# EAGLE design TS_OD1 (EAGLE 7.2.0)
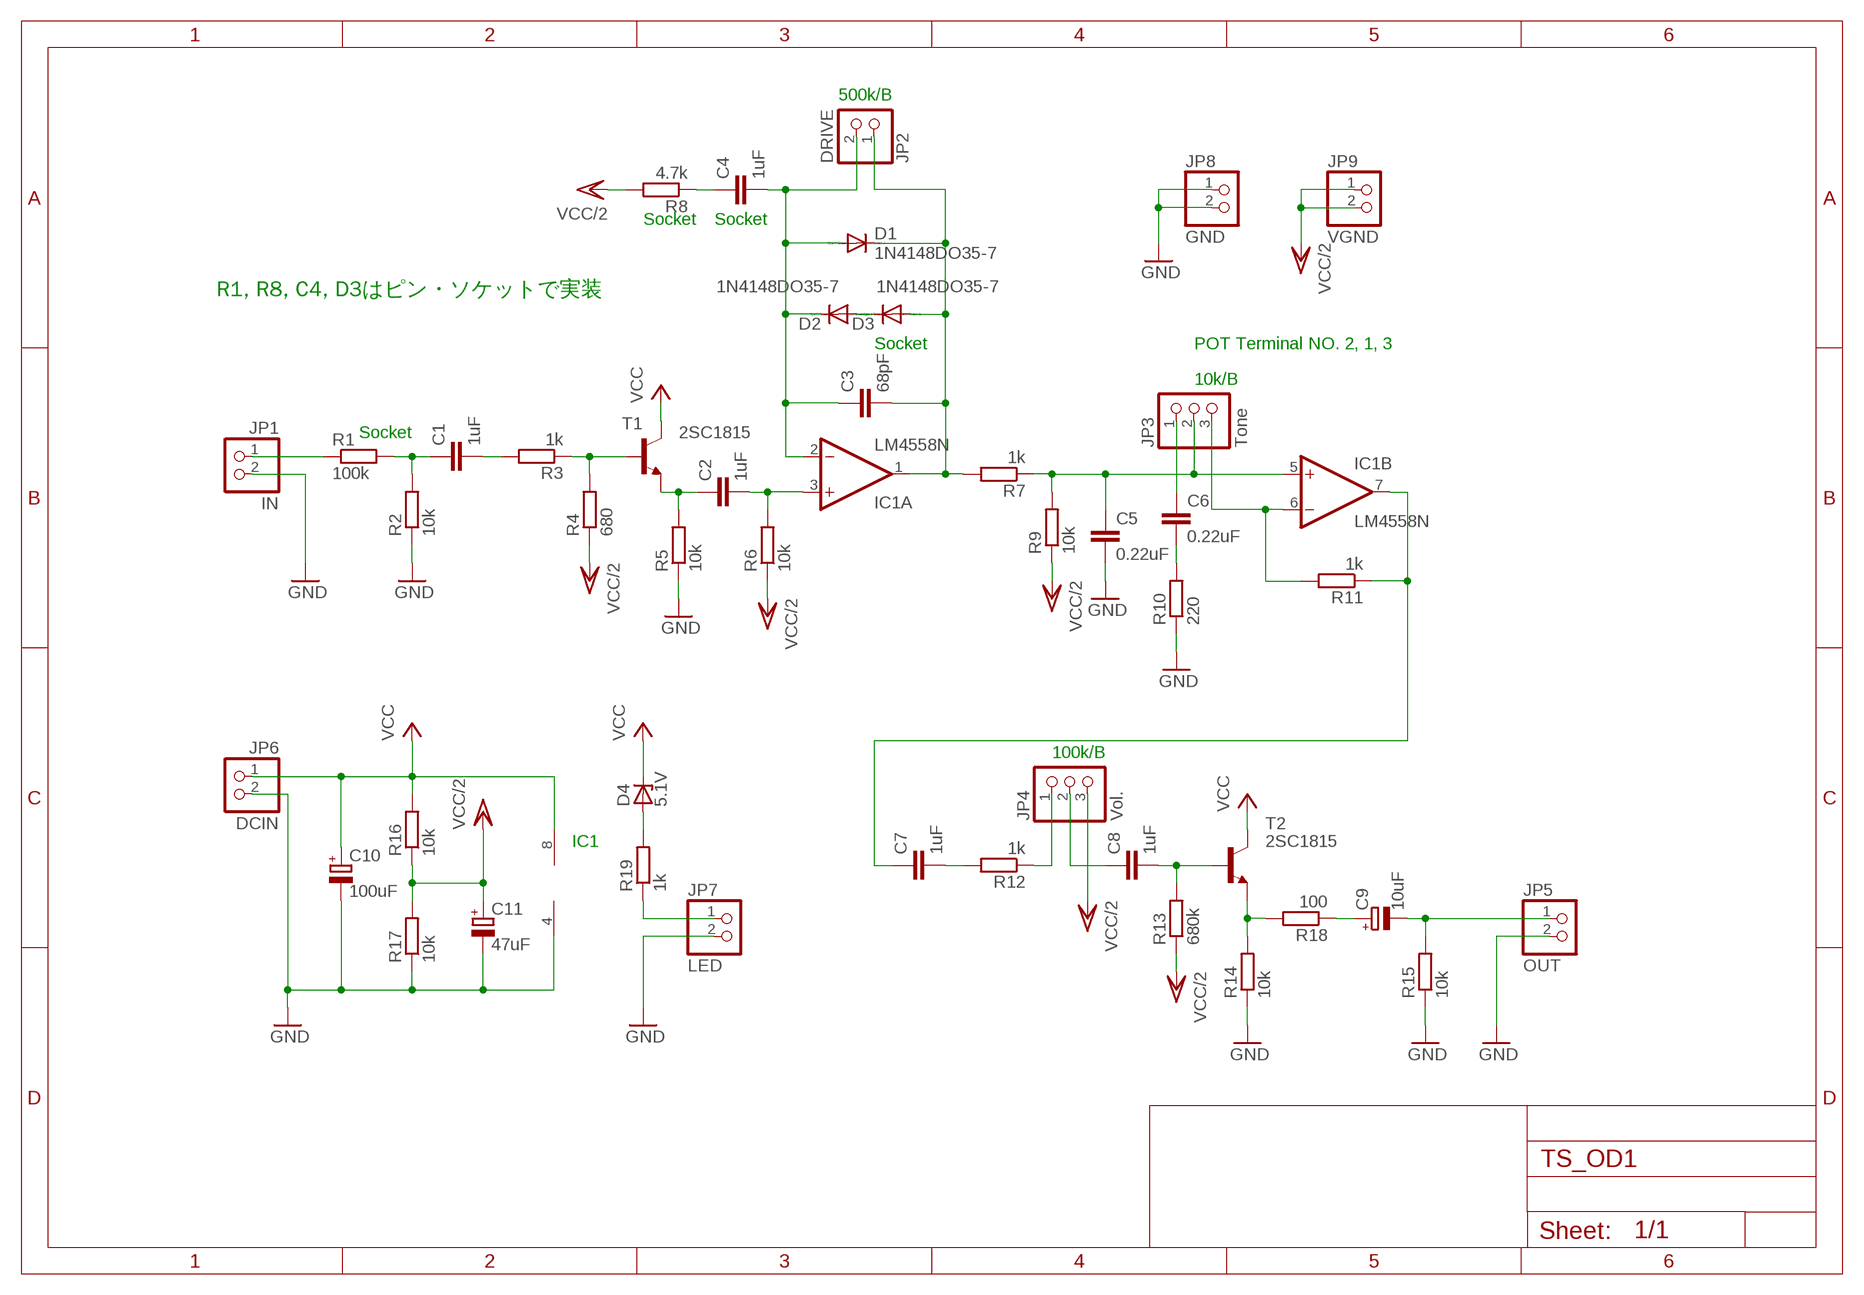
[diagram p0: schematic, sheet 1]

## Parts
C1  1uF  C-EU050-050X075  [C050-050X075]
C2  1uF  C-EU050-050X075  [C050-050X075]
C3  68pF  C-EU050-024X044  [C050-024X044]
C4  1uF  C-EU050-050X075  [C050-050X075]
C5  0.22uF  C-EU050-035X075  [C050-035X075]
C6  0.22uF  C-EU050-035X075  [C050-035X075]
C7  1uF  C-EU050-050X075  [C050-050X075]
C8  1uF  C-EU050-050X075  [C050-050X075]
C9  10uF  CPOL-EUE2.5-5  [E2,5-5]
C10  100uF  CPOL-EUE5-6  [E5-6]
C11  47uF  CPOL-EUE5-6  [E5-6]
D1  1N4148DO35-7  [DO35-7]
D2  1N4148DO35-7  [DO35-7]
D3  1N4148DO35-7  [DO35-7]
D4  5.1V  ZENER-DIODEZD-7.5  [ZDIO-7.5]
IC1  LM4558N  [DIL08]
JP1  IN  PINHD-1X2  [1X02]
JP2  DRIVE  PINHD-1X2  [1X02]
JP3  Tone  PINHD-1X3  [1X03]
JP4  Vol.  PINHD-1X3  [1X03]
JP5  OUT  PINHD-1X2  [1X02]
JP6  DCIN  PINHD-1X2  [1X02]
JP7  LED  PINHD-1X2  [1X02]
JP8  GND  PINHD-1X2  [1X02]
JP9  VGND  PINHD-1X2  [1X02]
R1  100k  R-EU_0207/7  [0207/7]
R2  10k  R-EU_0207/7  [0207/7]
R3  1k  R-EU_0207/7  [0207/7]
R4  680  R-EU_0207/7  [0207/7]
R5  10k  R-EU_0207/7  [0207/7]
R6  10k  R-EU_0207/7  [0207/7]
R7  1k  R-EU_0207/10  [0207/10]
R8  4.7k  R-EU_0207/7  [0207/7]
R9  10k  R-EU_0207/7  [0207/7]
R10  220  R-EU_0207/7  [0207/7]
R11  1k  R-EU_0207/7  [0207/7]
R12  1k  R-EU_0207/7  [0207/7]
R13  680k  R-EU_0207/7  [0207/7]
R14  10k  R-EU_0207/7  [0207/7]
R15  10k  R-EU_0207/7  [0207/7]
R16  10k  R-EU_0207/7  [0207/7]
R17  10k  R-EU_0207/7  [0207/7]
R18  100  R-EU_0207/7  [0207/7]
R19  1k  R-EU_0207/7  [0207/7]
T1  2SC1815  -NPN-TO92-ECB  [TO92-ECB]
T2  2SC1815  -NPN-TO92-ECB  [TO92-ECB]

## Nets
GND: C5.2 C10.- C11.- IC1.4(P:V-) JP1.2 JP5.2 JP6.2 JP7.2 JP8.1 JP8.2 R2.1 R5.1 R10.1 R14.1 R15.1 R17.1
N$1: JP1.1 R1.1
N$2: C1.1 R1.2 R2.2
N$3: C1.2 R3.2
N$4: C5.1 IC1.5(B:+IN) JP3.2 R7.1 R9.2
N$5: R3.1 R4.2 T1.B
N$6: C2.1 R5.2 T1.E
N$7: C2.2 IC1.3(A:+IN) R6.2
N$8: C3.1 C4.2 D1.A D2.C IC1.2(A:-IN) JP2.2
N$9: D2.A D3.C
N$10: C3.2 D1.C D3.A IC1.1(A:OUT) JP2.1 R7.2
N$11: C4.1 R8.1
N$12: IC1.6(B:-IN) JP3.3 R11.2
N$13: C6.2 R10.2
N$14: C6.1 JP3.1
N$15: C7.1 IC1.7(B:OUT) R11.1
N$16: C7.2 R12.2
N$17: JP4.1 R12.1
N$18: C8.1 JP4.2
N$19: C8.2 R13.2 T2.B
N$20: R14.2 R18.2 T2.E
N$21: C9.- JP5.1 R15.2
N$22: C9.+ R18.1
N$23: D4.A R19.2
N$25: JP7.1 R19.1
VCC: C10.+ D4.C IC1.8(P:V+) JP6.1 R16.2 T1.C T2.C
VCC/2: C11.+ JP4.3 JP9.1 JP9.2 R4.1 R6.1 R8.2 R9.1 R13.1 R16.1 R17.2

## Notes on the sheet
- 500k/B
- Socket | Socket
- R1, R8, C4, D3はピン・ソケットで実装
- Socket | POT Terminal NO. 2, 1, 3
- 10k/B
- Socket
- 100k/B
- IC1

## Library data of the parts
C1-C8 = rcl:C-EU: CAPACITOR, European symbol
C9-C11 = rcl:CPOL-EU: POLARIZED CAPACITOR, European symbol
D1-D3 = diode:1N4148: DIODE high speed (Philips)
D4 = diode:ZENER-DIODE: Z-Diode
IC1 = linear:*4558: OP AMP
JP1 JP2 JP5-JP9 = pinhead:PINHD-1X2: PIN HEADER
JP3 JP4 = pinhead:PINHD-1X3: PIN HEADER
R1-R19 = rcl:R-EU_: RESISTOR, European symbol
T1 T2 = transistor:*-NPN-: NPN Transistror BF959 corrected 2008.03.06

## Board
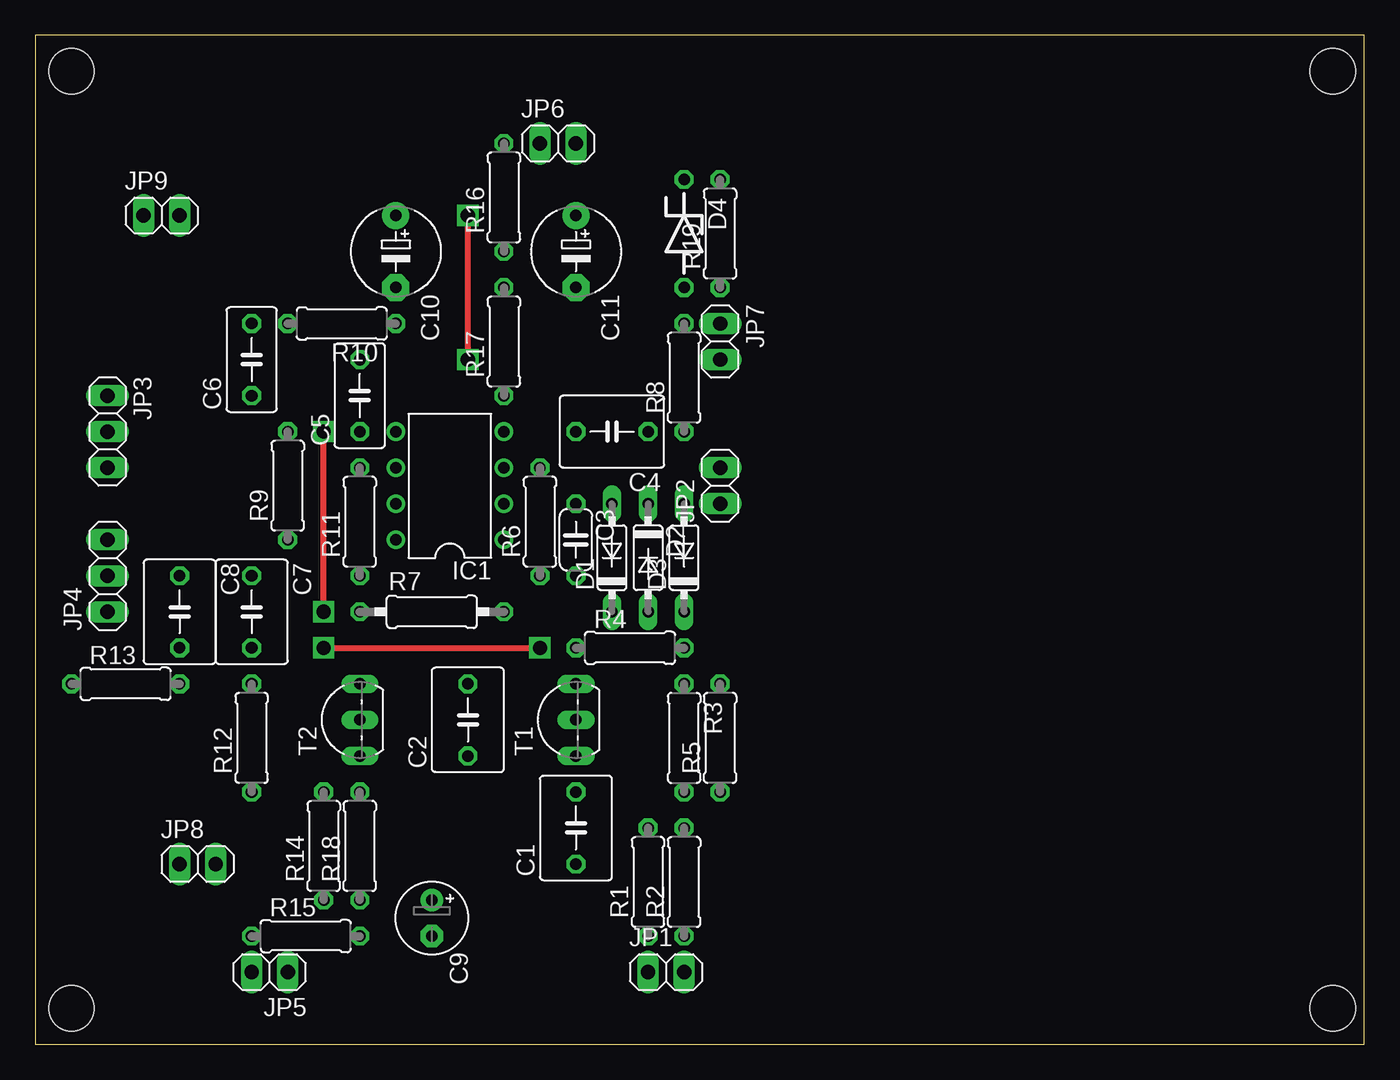
[diagram p1: board, top side]
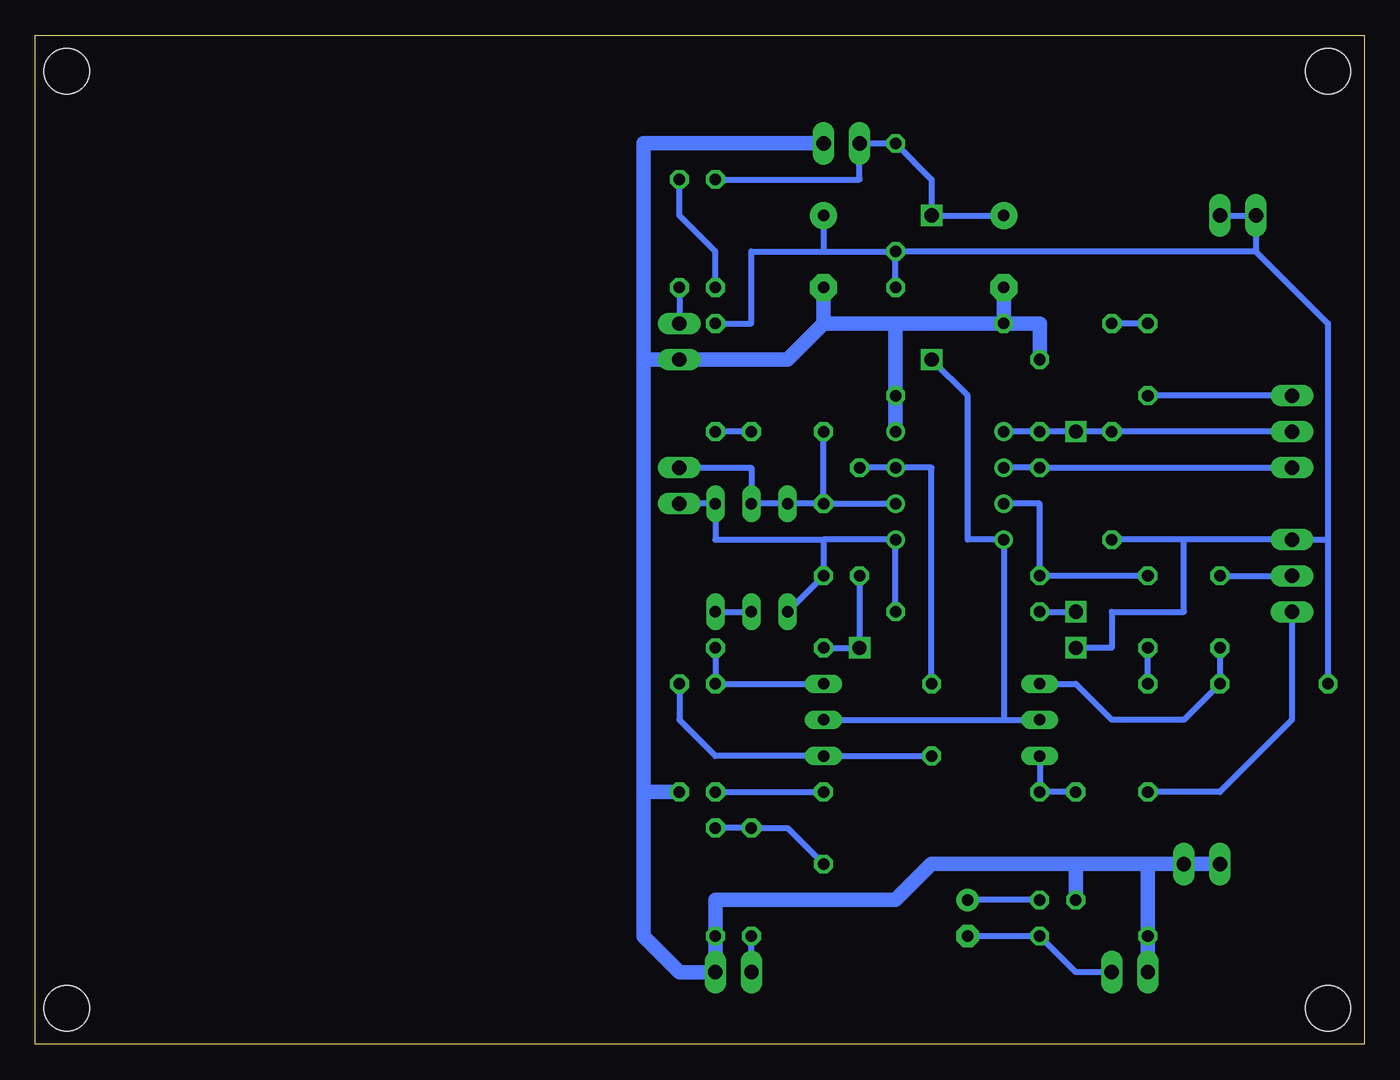
[diagram p2: board, bottom side, seen from below]

Size 93.65 x 71.11 mm. Coordinates in mm from the lower left corner, seen from the top.
Outline: 0,0 93.65,0 93.65,71.11 0,71.11 0,0
Copper layers (1*16): Top 0.035mm / dielectric 1.5mm / Bottom 0.035mm
Design rules "default": minimum track width 10mil, minimum drill 24mil, track to track 8mil, track to pad 8mil, pad to pad 8mil, via to via 8mil, smd to smd 8mil, copper to edge 40mil, drill to drill 8mil, minimum pad ring 10mil, minimum via ring 8mil, stop-mask expansion 4mil, vias tented up to drill 0mil, thermal gap 10mil
Holes 3.2 mm at 2.54,68.58 2.54,2.54 91.44,2.54 91.44,68.58

### Footprints (pad centres in the part's own frame; a part is rotated, then mirrored left to right if it is on the bottom)
C050-050X075 = drill 0.813 octagon: 1 -2.54,0; 2 2.54,0
C050-024X044 = drill 0.813 octagon: 1 -2.54,0; 2 2.54,0
C050-035X075 = drill 0.813 octagon: 1 -2.54,0; 2 2.54,0
E2,5-5 = drill 0.813 pad 1.6: + -1.27,0 | drill 0.813 pad 1.6 octagon: - 1.27,0
E5-6 = drill 0.813 pad 1.905: + -2.54,0 | drill 0.813 pad 1.905 octagon: - 2.54,0
DO35-7 = drill 0.813 long: A 3.81,0; C -3.81,0
ZDIO-7.5 = drill 0.813 octagon: A 3.81,0; C -3.81,0
DIL08 = drill 0.813 pad 1.27: 1 -3.81,-3.81; 2 -1.27,-3.81; 3 1.27,-3.81; 4 3.81,-3.81; 5 3.81,3.81; 6 1.27,3.81; 7 -1.27,3.81; 8 -3.81,3.81
1X02 = drill 1.016 long: 1 -1.27,0; 2 1.27,0
1X03 = drill 1.016 long: 1 -2.54,0; 2 0,0; 3 2.54,0
0207/7 = drill 0.813 octagon: 1 -3.81,0; 2 3.81,0
0207/10 = drill 0.813 octagon: 1 -5.08,0; 2 5.08,0
TO92-ECB = drill 0.813 long: B 2.54,0; C 0,0; E -2.54,0

### Placement (x,y rotation side)
C1  38.1,15.24 90 top
C2  30.48,22.86 90 top
C3  38.1,35.56 270 top
C4  40.64,43.18 180 top
C5  22.86,45.72 90 top
C6  15.24,48.26 90 top
C7  15.24,30.48 270 top
C8  10.16,30.48 270 top
C9  27.94,8.89 270 top
C10  25.4,55.88 270 top
C11  38.1,55.88 270 top
D1  40.64,34.29 90 top
D2  43.18,34.29 270 top
D3  45.72,34.29 90 top
D4  45.72,57.15 270 top
IC1  29.21,39.37 90 top
JP1  44.45,5.08 0 top
JP2  48.26,39.37 90 top
JP3  5.08,43.18 270 top
JP4  5.08,33.02 90 top
JP5  16.51,5.08 180 top
JP6  36.83,63.5 0 top
JP7  48.26,49.53 270 top
JP8  11.43,12.7 0 top
JP9  8.89,58.42 0 top
R1  43.18,11.43 90 top
R2  45.72,11.43 90 top
R3  45.72,21.59 270 top
R4  41.91,27.94 0 top
R5  48.26,21.59 90 top
R6  35.56,36.83 90 top
R7  27.94,30.48 0 top
R8  45.72,46.99 90 top
R9  17.78,39.37 90 top
R10  21.59,50.8 180 top
R11  22.86,36.83 90 top
R12  15.24,21.59 90 top
R13  6.35,25.4 0 top
R14  20.32,13.97 90 top
R15  19.05,7.62 0 top
R16  33.02,59.69 90 top
R17  33.02,49.53 90 top
R18  22.86,13.97 90 top
R19  48.26,57.15 90 top
T1  38.1,22.86 90 top
T2  22.86,22.86 90 top

### Tracks (layer width: path | path; a pad name or v marks a point on that pad's centre or on a via)
GND
  Bottom 1.016: R10.1 33.02,50.8 | 33.02,50.8 R17.1 IC1.4 | R10.1 22.86,50.8 C5.2 | 38.1,50.8 40.64,48.26 JP7.2 50.8,48.26 | 38.1,50.8 33.02,50.8 | C11.- 38.1,50.8 | JP6.2 50.8,63.5 50.8,48.26 | R5.1 50.8,17.78 | 50.8,17.78 50.8,48.26 | C10.- R10.1 | 50.8,17.78 50.8,7.62 48.26,5.08 JP1.2 R2.1 45.72,10.16 33.02,10.16 30.48,12.7 20.32,12.7 | JP5.2 R15.1 15.24,12.7 | R14.1 20.32,12.7 | JP8.1 JP8.2 15.24,12.7 | 15.24,12.7 20.32,12.7
N$1
  Bottom 0.406: JP1.1 R1.1
N$2
  Bottom 0.406: R2.2 R1.2 40.64,15.24 C1.1
N$3
  Bottom 0.406: R3.2 C1.2
N$4  (via drill 1)
  Top 0.406: v20.32,30.48 v20.32,43.18
  Bottom 0.406: IC1.5 C5.1 v20.32,43.18 R9.2 JP3.2 | R7.1 v20.32,30.48
N$5
  Bottom 0.406: R4.2 R3.1 T1.B
N$6
  Bottom 0.406: C2.1 T1.E 45.72,20.32 48.26,22.86 R5.2
N$7
  Bottom 0.406: R6.2 IC1.3 30.48,40.64 C2.2
N$8
  Bottom 0.406: C3.1 IC1.2 | C3.1 D1.A D2.C 43.18,40.64 JP2.2 | C3.1 C4.2
N$9
  Bottom 0.406: D3.C D2.A
N$10
  Bottom 0.406: 38.1,35.56 IC1.1 R7.2 | 38.1,35.56 C3.2 D1.C | 38.1,35.56 45.72,35.56 D3.A JP2.1
N$11
  Bottom 0.406: C4.1 R8.1
N$12
  Bottom 0.406: IC1.6 R11.2 JP3.3
N$13
  Bottom 0.406: C6.2 R10.2
N$14
  Bottom 0.406: JP3.1 C6.1
N$15
  Bottom 0.406: IC1.7 22.86,38.1 R11.1 C7.1
N$16
  Bottom 0.406: R12.2 C7.2
N$17
  Bottom 0.406: JP4.1 5.08,22.86 10.16,17.78 R12.1
N$18
  Bottom 0.406: C8.1 JP4.2
N$19
  Bottom 0.406: C8.2 R13.2 12.7,22.86 17.78,22.86 20.32,25.4 T2.B
N$20
  Bottom 0.406: T2.E R18.2 R14.2
N$21
  Bottom 0.406: C9.- R15.2 20.32,5.08 JP5.1
N$22
  Bottom 0.406: R18.1 C9.+
N$23
  Bottom 0.406: D4.A 45.72,55.88 48.26,58.42 R19.2
N$25
  Bottom 0.406: R19.1 JP7.1
VCC  (via drill 1)
  Top 0.406: v30.48,48.26 v30.48,58.42
  Bottom 0.406: T1.C 25.4,22.86 | 25.4,22.86 T2.C | 25.4,22.86 IC1.8 27.94,35.56 27.94,45.72 v30.48,48.26 | C10.+ v30.48,58.42 30.48,60.96 R16.2 JP6.1 35.56,60.96 D4.C
VCC/2  (via drill 1)
  Top 0.406: v20.32,27.94 v35.56,27.94
  Bottom 0.406: R17.2 R16.1 | 2.54,35.56 JP4.3 12.7,35.56 | 2.54,35.56 R13.1 | 2.54,35.56 2.54,50.8 7.62,55.88 | 12.7,35.56 12.7,30.48 17.78,30.48 17.78,27.94 v20.32,27.94 | 12.7,35.56 R9.1 | 7.62,55.88 R16.1 | 38.1,55.88 R16.1 | C11.+ 38.1,55.88 | R8.2 43.18,50.8 43.18,55.88 38.1,55.88 | JP9.2 JP9.1 7.62,55.88 | R4.1 v35.56,27.94 R6.1

### Text on the board
Reference: CutOff